# EAGLE design Mirley_USB-UART (EAGLE 9.5.1)

## Sheet 1 of 2: Mirley board to evaluate ESP8266
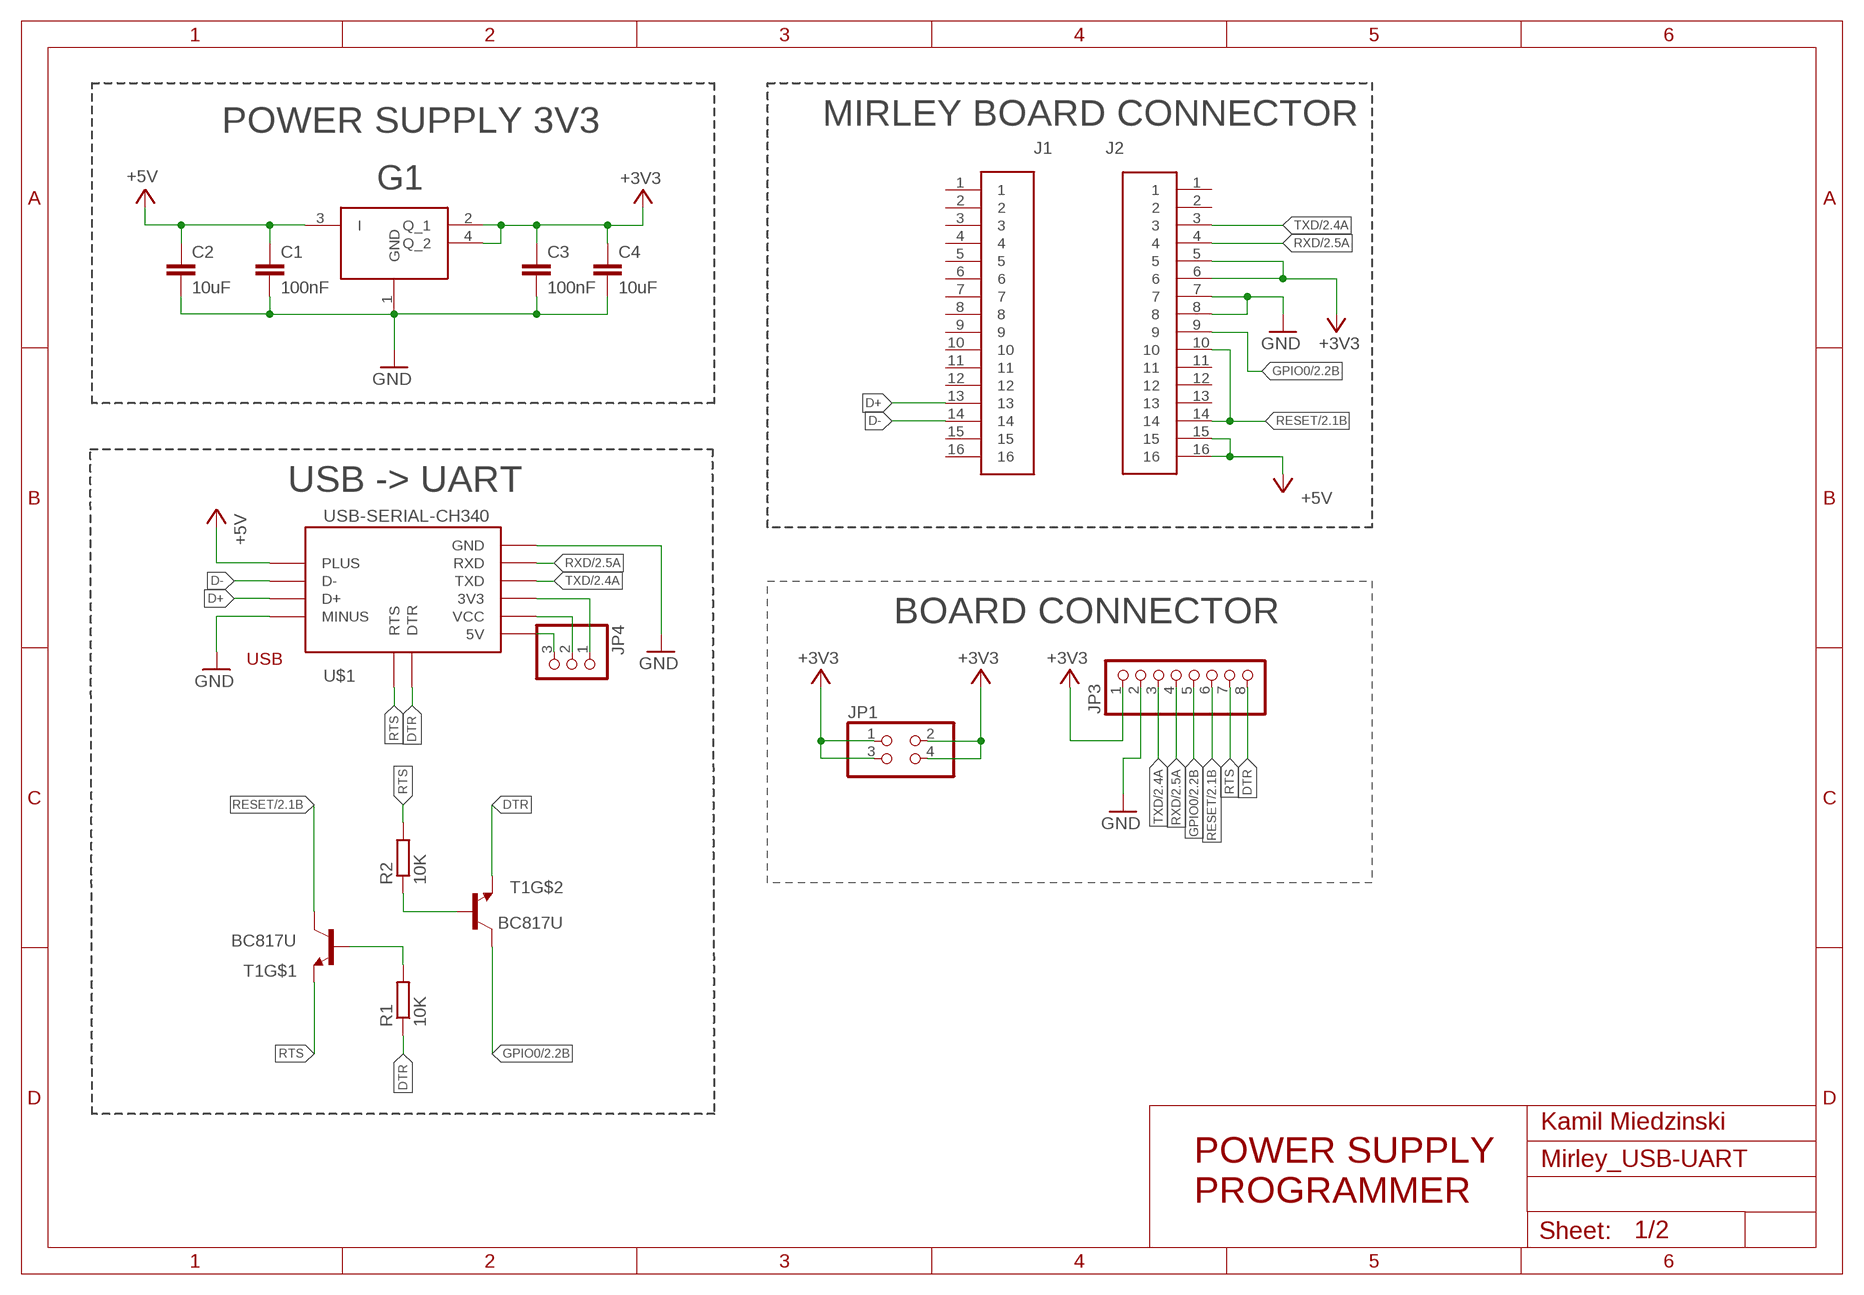
[diagram p0: schematic, sheet 1]

### Parts
C1  100nF  C-EUC0805K  [C0805K]
C2  10uF  C-EUC0805K  [C0805K]
C3  100nF  C-EUC0805K  [C0805K]
C4  10uF  C-EUC0805K  [C0805K]
G1  IFX1117ME_V33  [SOT230P700X170-4N-1]
J1  61301611121  [61301611121]
J2  61301611121  [61301611121]
JP1  PINHD-2X2  [2X02]
JP3  PINHD-1X8  [1X08]
JP4  PINHD-1X3  [1X03]
R1  10K  R-EU_R0805  [R0805]
R2  10K  R-EU_R0805  [R0805]
T1  BC817U  [INF-SC74]
U$1  USB-SERIAL-CH340  [USB-SERIAL-CH340]

### Nets
+3V3: C3.1 C4.1 G1.2(Q_1) G1.4(Q_2) J2.5 J2.6 JP1.1 JP1.2 JP1.3 JP1.4 JP3.1 ; also sheet 2
+5V: C1.1 C2.1 G1.3(I) J2.15 J2.16 U$1.PLUS ; also sheet 2
D+: J1.13 U$1.D+
D-: J1.14 U$1.D-
DTR: JP3.8 R1.1 T1.4(E) U$1.DTR
GND: C1.2 C2.2 C3.2 C4.2 G1.1(GND) J2.7 J2.8 JP3.2 U$1.GND U$1.MINUS ; also sheet 2
GPIO0: J2.9 JP3.5 T1.3(C) ; also sheet 2
N$1: R2.1 T1.5(B)
N$2: R1.2 T1.2(B)
N$5: JP4.3 U$1.5V
N$11: JP4.2 U$1.VCC
N$13: JP4.1 U$1.3V3
RESET: J2.10 J2.14 JP3.6 T1.6(C) ; also sheet 2
RTS: JP3.7 R2.2 T1.1(E) U$1.RTS
RXD: J2.4 JP3.4 U$1.RXD ; also sheet 2
TXD: J2.3 JP3.3 U$1.TXD ; also sheet 2
Unconnected: J1.1 J1.2 J1.3 J1.4 J1.5 J1.6 J1.7 J1.8 J1.9 J1.10 J1.11 J1.12 J1.15 J1.16 J2.1 J2.2 J2.11 J2.12 J2.13

### Notes on the sheet
- POWER SUPPLY 3V3 | MIRLEY BOARD CONNECTOR
- USB -> UART
- BOARD CONNECTOR
- Kamil Miedzinski
- POWER SUPPLY
  PROGRAMMER

## Sheet 2 of 2: Connector to adapter ESP8266 01, 07, 12
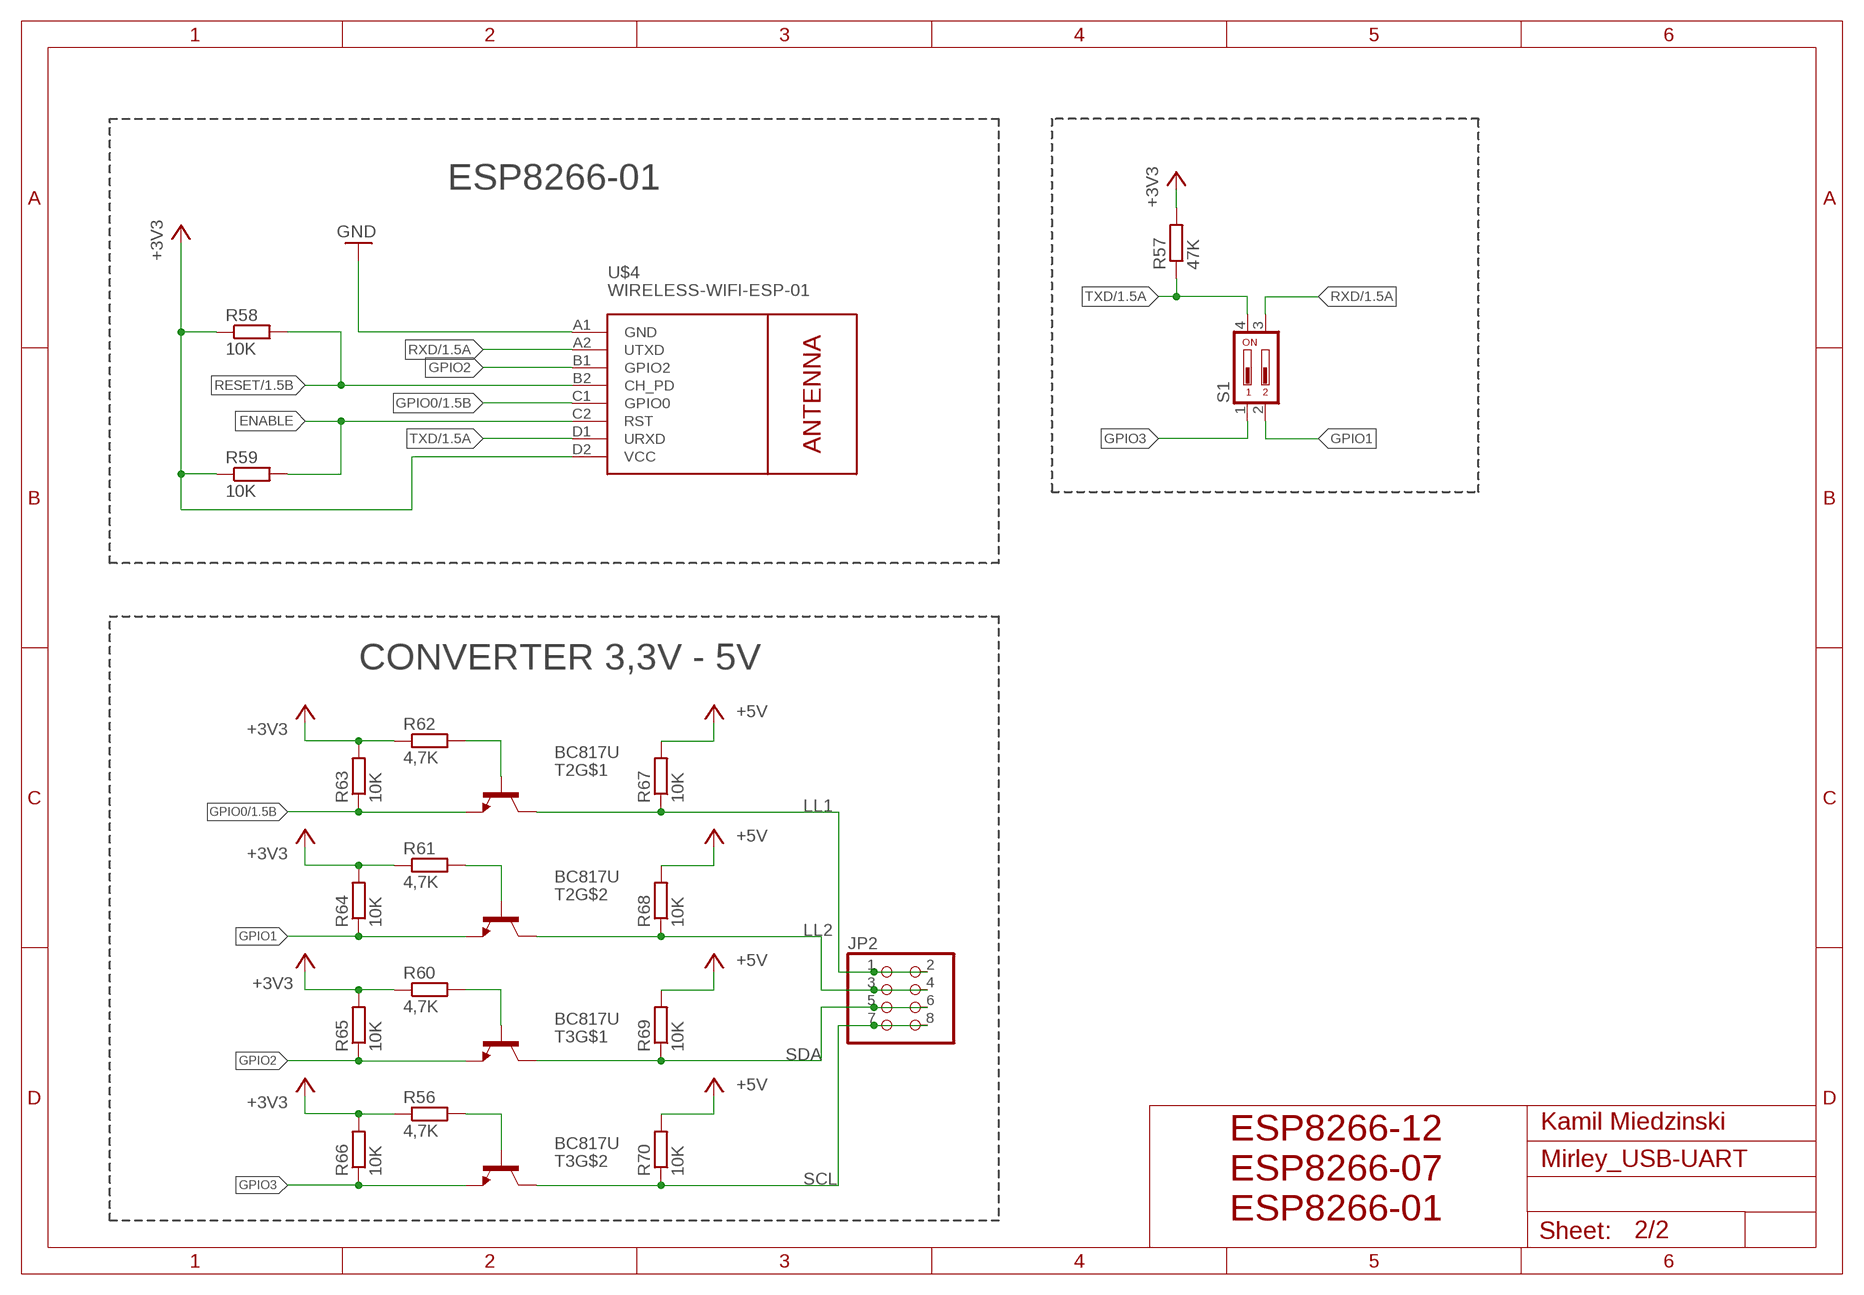
[diagram p1: schematic, sheet 2]

### Parts
JP2  PINHD-2X4  [2X04]
R56  4,7K  R-EU_R0805  [R0805]
R57  47K  R-EU_R0805  [R0805]
R58  10K  R-EU_R0805  [R0805]
R59  10K  R-EU_R0805  [R0805]
R60  4,7K  R-EU_R0805  [R0805]
R61  4,7K  R-EU_R0805  [R0805]
R62  4,7K  R-EU_R0805  [R0805]
R63  10K  R-EU_R0805  [R0805]
R64  10K  R-EU_R0805  [R0805]
R65  10K  R-EU_R0805  [R0805]
R66  10K  R-EU_R0805  [R0805]
R67  10K  R-EU_R0805  [R0805]
R68  10K  R-EU_R0805  [R0805]
R69  10K  R-EU_R0805  [R0805]
R70  10K  R-EU_R0805  [R0805]
S1  DIP02YL  [DIP02YL]
T2  BC817U  [INF-SC74]
T3  BC817U  [INF-SC74]
U$4  WIRELESS-WIFI-ESP-01  [WIRELESS-WIFI-ESP-01]

### Nets
+3V3: R56.1 R57.2 R58.1 R59.1 R60.1 R61.1 R62.1 R63.2 R64.2 R65.2 R66.2 U$4.D2(VCC) ; also sheet 1
+5V: R67.2 R68.2 R69.2 R70.2 ; also sheet 1
ENABLE: R59.2 U$4.C2(RST)
GND: U$4.A1(GND) ; also sheet 1
GPIO0: R63.1 T2.1(E) U$4.C1(GPIO0) ; also sheet 1
GPIO1: R64.1 S1.2 T2.4(E)
GPIO2: R65.1 T3.1(E) U$4.B1(GPIO2)
GPIO3: R66.1 S1.1 T3.4(E)
LL1: JP2.1 JP2.2 R67.1 T2.6(C)
LL2: JP2.3 JP2.4 R68.1 T2.3(C)
N$17: R62.2 T2.2(B)
N$18: R61.2 T2.5(B)
N$19: R60.2 T3.2(B)
N$21: R56.2 T3.5(B)
RESET: R58.2 U$4.B2(CH_PD) ; also sheet 1
RXD: S1.3 U$4.A2(UTXD) ; also sheet 1
SCL: JP2.7 JP2.8 R70.1 T3.3(C)
SDA: JP2.5 JP2.6 R69.1 T3.6(C)
TXD: R57.1 S1.4 U$4.D1(URXD) ; also sheet 1

### Notes on the sheet
- ESP8266-01
- CONVERTER 3,3V - 5V
- Kamil Miedzinski
- ESP8266-12
  ESP8266-07
  ESP8266-01

## Library data of the parts
C1-C4 = rcl:C-EU: CAPACITOR, European symbol; SPICEPREFIX: C
G1 = infineon:IFX1117ME_V33: IFX1117ME V33 SOT230P700X170-4N-1 Voltage Regulator
J1 J2 = Headers:61301611121: CONN HEADER VERT 16POS 2.54MM Manufacturer's datasheet <https://katalog.we-online.de/em/datasheet/6130xx11121.pdf>; CREATED_BY: PCBLayout.com; DIGIKEY_PART_NUMBER: 732-5327-ND; MANUFACTURER: Wurth Electronics Inc.; MPN: 61301611121
JP1 = pinhead:PINHD-2X2: PIN HEADER; SPICEPREFIX: E
JP2 = pinhead:PINHD-2X4: PIN HEADER
JP3 = pinhead:PINHD-1X8: PIN HEADER
JP4 = pinhead:PINHD-1X3: PIN HEADER
R1 R2 R56-R70 = rcl:R-EU_: RESISTOR, European symbol; SPICEPREFIX: R
S1 = switch-dil:DIP02YL: DIL/CODE SWITCH; OC_FARNELL: unknown; OC_NEWARK: unknown
T1-T3 = transistor:BC817U: NPN TRANSISTOR
U$1 = diy-modules:USB-SERIAL-CH340: USB to Serial UART Converter based on CP2102 chip More information about CP2102 chip is available here: https://www.silabs.com/documents/public/data-sheets/CP2102-9.pdf Drivers for CP210x devices are available here: http://www.silabs.com/products/development-tools/software/usb-to-uart-bridge-vcp-drivers Click here to find device on ebay.com <http://www.ebay.com/sch/cp2102+micro+usb>
U$4 = diy-modules:WIRELESS-WIFI-ESP-01: Wireless Wi-Fi ESP-01 Module based on ESP8266 chip Click here to find device on ebay.com <http://www.ebay.com/sch/esp8266+esp+01+transceiver>

## Board
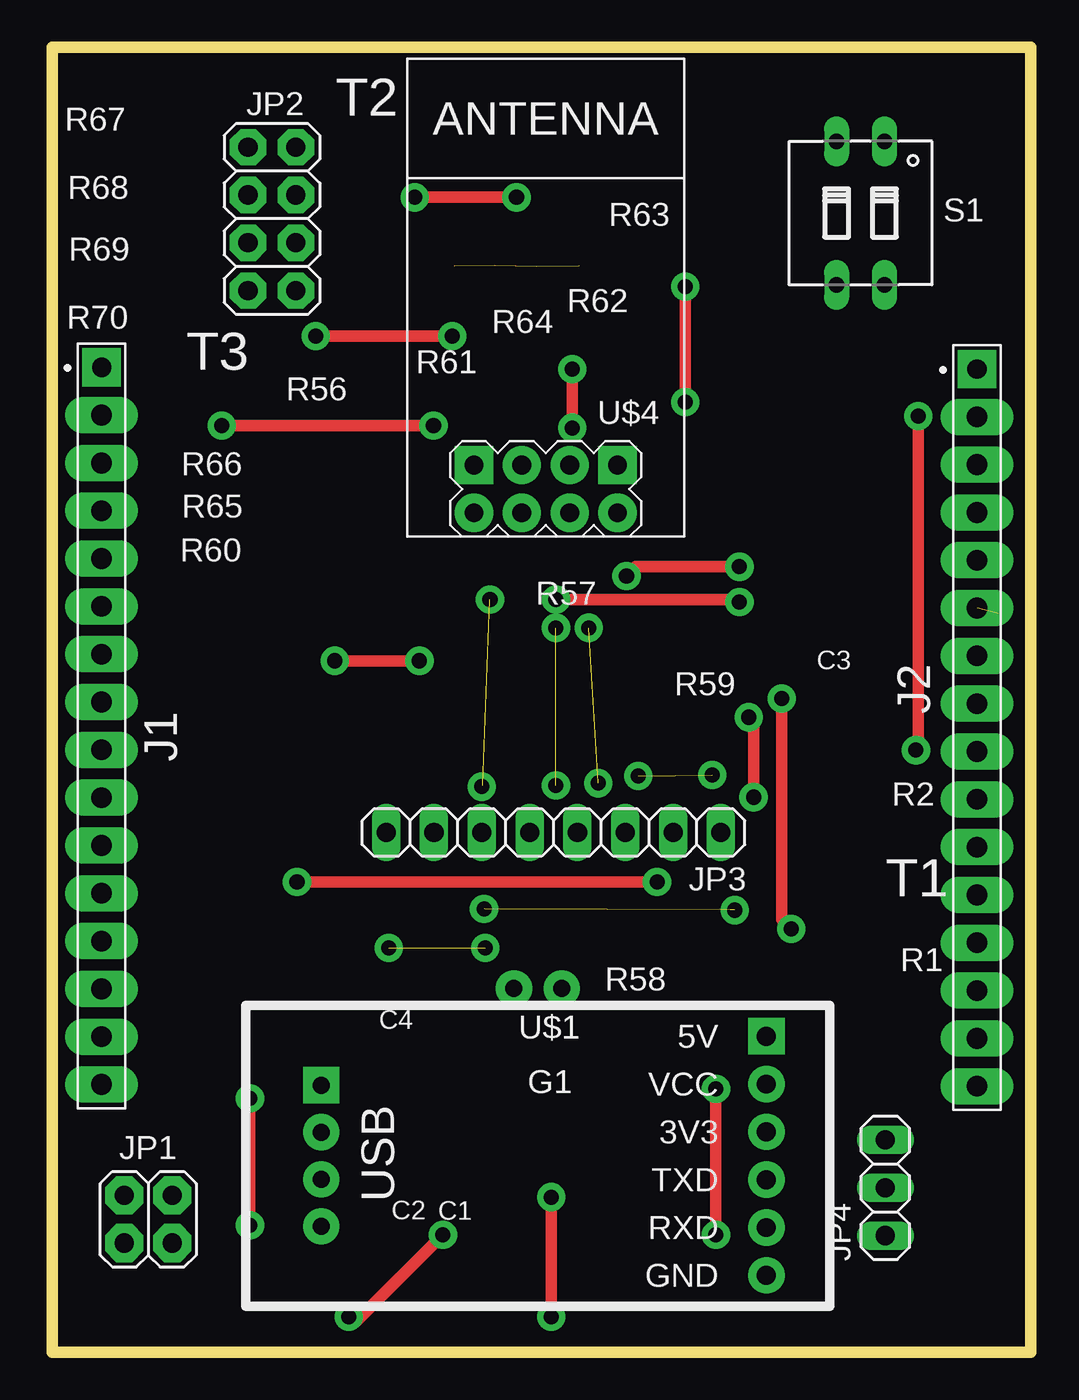
[diagram p2: board, top side]
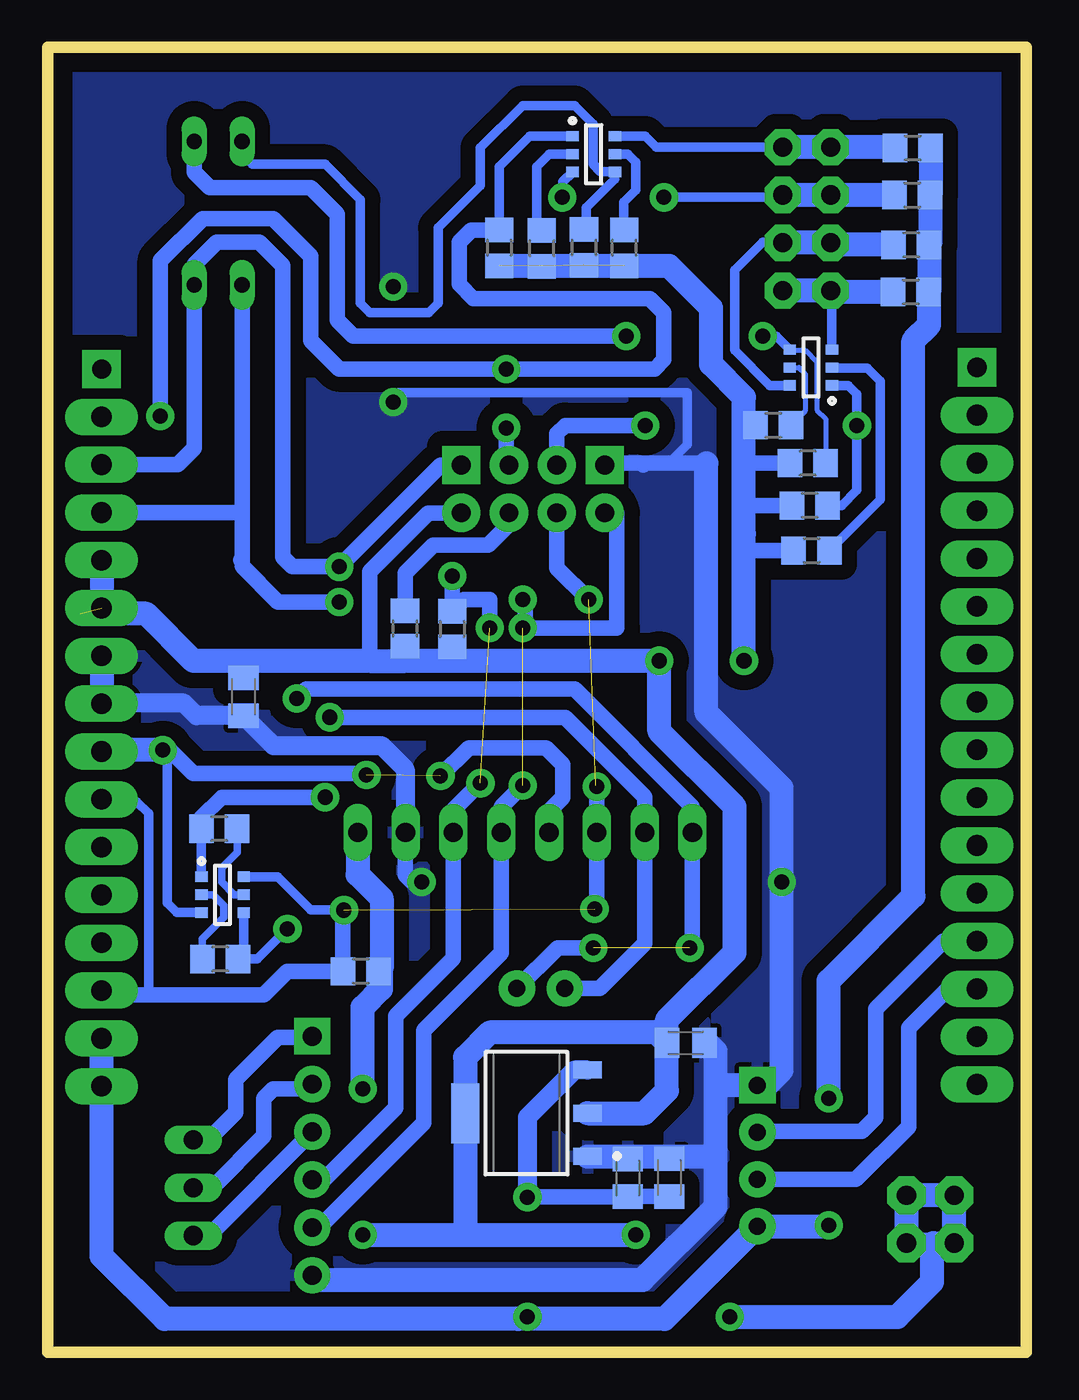
[diagram p3: board, bottom side, seen from below]

Size 51.97 x 69.36 mm. Coordinates in mm from the lower left corner, seen from the top.
Outline: 0,0 51.97,0 51.97,69.36 0,69.36 0,0
Copper layers (1*16): Top 0.035mm / dielectric 1.5mm / Bottom 0.035mm
Design rules "default": minimum track width 6mil, minimum drill 0.35mm, track to track 6mil, track to pad 6mil, pad to pad 6mil, via to via 6mil, smd to smd 6mil, copper to edge 40mil, drill to drill 6mil, minimum pad ring 10mil, minimum via ring 8mil, stop-mask expansion 4mil, vias tented up to drill 0mil, thermal gap 10mil

### Footprints (pad centres in the part's own frame; a part is rotated, then mirrored left to right if it is on the bottom)
C0805K = smd 1.3 x 1.6: 1 -1,0; 2 1,0
SOT230P700X170-4N-1 = smd 1.5 x 0.9: 1 -3.25,2.3; 2 -3.25,0; 3 -3.25,-2.3 | smd 1.5 x 3.2: 4 3.25,0
61301611121 = drill 1.016 pad 2.032 square: 1 -19.05,0 | drill 1.1 pad 1.93 long: 2 -16.51,0; 3 -13.97,0; 4 -11.43,0; 5 -8.89,0; 6 -6.35,0; 7 -3.81,0; 8 -1.27,0; 9 1.27,0; 10 3.81,0; 11 6.35,0; 12 8.89,0; 13 11.43,0; 14 13.97,0; 15 16.51,0; 16 19.05,0
2X02 = drill 1.016 pad 2.032 octagon: 1 -1.27,-1.27; 2 -1.27,1.27; 3 1.27,-1.27; 4 1.27,1.27
2X04 = drill 1.016 pad 1.93 octagon: 1 -3.81,-1.27; 2 -3.81,1.27; 3 -1.27,-1.27; 4 -1.27,1.27; 5 1.27,-1.27; 6 1.27,1.27; 7 3.81,-1.27; 8 3.81,1.27
1X08 = drill 1.016 long: 1 -8.89,0; 2 -6.35,0; 3 -3.81,0; 4 -1.27,0; 5 1.27,0; 6 3.81,0; 7 6.35,0; 8 8.89,0
1X03 = drill 1.016 long: 1 -2.54,0; 2 0,0; 3 2.54,0
R0805 = smd 1.3 x 1.5: 1 -0.95,0; 2 0.95,0
DIP02YL = drill 0.813 long: 1 -1.27,-3.81; 2 1.27,-3.81; 3 1.27,3.81; 4 -1.27,3.81
INF-SC74 = smd 0.65 x 0.55: 1 -1.125,0.95; 2 -1.125,0; 3 -1.125,-0.95; 4 1.125,-0.95; 5 1.125,0; 6 1.125,0.95
USB-SERIAL-CH340 = drill 1 pad 1.93: 3V3 12.14,1.27; GND 12.14,-6.35; RXD 12.14,-3.81; TXD 12.14,-1.27; VCC 12.14,3.81 | drill 1 pad 1.93 square: 5V 12.14,6.35 | drill 0.9 pad 1.93: D+ -11.5,1.25; D- -11.5,-1.25; DTR 1.27,8.89; PLUS -11.5,-3.75; RTS -1.27,8.89 | drill 0.9 pad 1.93 square: MINUS -11.5,3.75
WIRELESS-WIFI-ESP-01 = drill 1 pad 2.032 square: A1 -8.89,3.81; D1 -8.89,-3.81 | drill 1 pad 2.032: A2 -11.43,3.81; B1 -8.89,1.27; B2 -11.43,1.27; C1 -8.89,-1.27; C2 -11.43,-1.27; D2 -11.43,-3.81

### Placement (x,y rotation side)
C1  21.17,9.27 90 bottom
C2  18.96,9.29 90 bottom
C3  41.58,34.84 270 bottom
C4  18.09,16.44 0 bottom
G1  26.56,12.71 180 bottom
J1  2.62,33.29 270 top
J2  49.12,33.2 270 top
JP1  5.1,7.08 0 top
JP2  11.67,60.23 270 top
JP3  26.62,27.62 180 top
JP4  44.25,8.75 90 top
R1  42.82,20.9 180 bottom
R2  42.87,27.83 180 bottom
R56  13.45,49.27 0 bottom
R57  30.5,38.44 270 bottom
R58  35.36,20.25 180 bottom
R59  33,38.46 90 bottom
R60  11.41,42.61 0 bottom
R61  21.36,58.69 90 bottom
R62  25.73,58.66 90 bottom
R63  28,58.69 270 bottom
R64  23.5,58.72 270 bottom
R65  11.51,45 180 bottom
R66  11.61,47.25 180 bottom
R67  6.04,64 0 bottom
R68  6.07,61.5 0 bottom
R69  6.12,58.85 0 bottom
R70  6.14,56.35 0 bottom
S1  42.93,60.54 180 top
T1  42.69,24.32 0 bottom
T2  22.98,63.67 0 bottom
T3  11.45,52.33 180 bottom
U$1  25.79,10.45 0 top
U$4  26.21,56.04 90 top

### Tracks (layer width: path | path; a pad name or v marks a point on that pad's centre or on a via)
+3V3  (via drill 0.8 pad 1.5)  (4 unrouted)
  Top 0.61: v35.25,14 v35.25,6.25 | v20.75,6.25 16.07,1.57 v15.75,1.89 | v19.5,36.75 v15,36.75
  Bottom 0.813: R58.1 34.15,19.98 | U$4.D2 31.77,44.61 34.88,41.51 34.88,36.75 | R66.2 15,47.25 | 14.98,43.52 15,43.5 | R65.2 15,45 | 15,42.5 14.89,42.61 R60.1 | R59.1 33,36.75 | 30.5,37.25 R57.2 30,36.99 30,36.75 30.5,37.25
  Bottom 1.016: R56.1 14.73,49.27 15,49
  Bottom 1.27: G1.2 20.29,12.71 19.09,13.91 C4.1 | G1.4 29.81,15.69 28.5,17 19.65,17 C4.1 | G1.4 29.81,11.94 | v35.25,14 35.25,18.34 34.28,19.31 34.28,20.12 R58.1 34.25,20.41 34.25,24.12 35.52,25.39 JP3.1 | C4.1 19.09,17.66 15.5,21.25 15.5,29 19.5,33 v19.5,36.75 30,36.75 33,36.75 34.88,36.75 42,36.75 | G1.4 29.81,6.56 29.5,6.25 | v35.25,6.25 29.5,6.25 | 29.5,6.25 v20.75,6.25 | v15.75,1.89 6.86,1.89 5,3.75 5,5.75 | 5,5.75 4.94,5.81 JP1.1 JP1.2 JP1.4 JP1.3 6.31,5.75 5,5.75 | 50.25,39.25 46.75,39.25 44.25,36.75 42,36.75 | C3.1 41.58,36.33 42,36.75 | v15,36.75 15,42.5 15,43.5 15,45 15,47.25 15,49 15,50.75 16.75,52.5 16.75,55.5 18.99,57.74 R63.2 | J2.5 J2.6
+5V  (via drill 0.8 pad 1.5)
  Top 0.61: v26.5,8.25 v26.5,1.89 | v10.5,6.75 v10.5,13.5
  Top 1.016: v26.5,1.89 26.5,1.75
  Bottom 0.813: C2.1 21.15,8.29 C1.1 26.48,8.27 v26.5,8.25 | R68.2 5.21,61.6 | R70.2 5.04,56.5
  Bottom 1.016: G1.3 23.99,15.01 26.5,12.5 v26.5,8.25 | v26.5,1.89 26.89,1.89 27,1.78
  Bottom 1.27: J2.15 J2.16 49.12,5.12 45.78,1.78 27,1.78 19.21,1.78 U$1.PLUS 10.55,6.7 v10.5,6.75 | v10.5,13.5 10.5,19.75 6,24.25 6,53.75 5.17,54.59 5.17,56.33 | 5.17,56.33 R70.2 | R67.2 5.09,61.52 R68.2 5.12,58.9 R69.2 5.17,56.33
D+
  Bottom 0.813: J1.13 4.39,21.86 8,18.25 8,12.5 8.75,11.75 14.24,11.75 U$1.D+
D-
  Bottom 0.813: J1.14 4.18,19.32 6.25,17.25 6.25,12 9.05,9.2 U$1.D-
DTR  (via drill 0.8 pad 1.5)  (1 unrouted)
  Top 0.61: v38.75,34.75 38.75,23 v39.25,22.5
  Bottom 0.508: T1.4 41.56,21.2 R1.1 40.85,20.9 v39.25,22.5
  Bottom 0.813: U$1.DTR 24.9,21.5 v23,21.5 | v38.75,34.75 38.25,35.25 24,35.25 17.73,28.98 JP3.8 17.73,21.64 v17.88,21.5
ENABLE
  Bottom 0.813: R59.2 33,41.41 31.5,42.91 28.59,42.91 27.48,44.02 U$4.C2
GND  (via drill 0.8 pad 1.5)
  Top 0.61: v13,25 v32.12,25 | v33.62,50.5 v33.62,56.62
  Bottom 0.508: 19,47.25 18,48.25 18,51 33.38,51 33.62,50.75 v33.62,50.5
  Bottom 0.813: 20.35,47.15 20.25,47.25 | 17,47.25 19,47.25 22.3,47.25 U$4.A1 | JP3.2 33,27.65 33,25.38 32.62,25 v32.12,25
  Bottom 1.016: 49.09,34.5 44.75,34.5 44.09,33.84 C3.2 40,32.25 34.25,32.25 33,31 33,27.65
  Bottom 1.27: U$1.GND 37.68,3.85 20.4,3.85 16.5,7.75 16.5,10.41 | G1.1 16.5,10.41 | C4.2 16.94,16.44 16.5,16 16.5,14 | 16.5,10.41 16.5,14 | 16.5,14 16.3,14.2 U$1.MINUS 13.8,14.2 13,15 v13,25 13,30 17,34 17,47.25 | J2.7 49.12,34.53 49.09,34.5
  pour Bottom (isolate 0.813): 0,69.36 0,0 51.97,0 51.97,69.36
GPIO0  (via drill 0.8 pad 1.5)  (1 unrouted)
  Top 0.61: v46,49.75 46,32.12 | v27.62,52.25 v27.62,49.12
  Top 0.813: v45.88,32 46,32.12
  Bottom 0.508: T2.1 26.38,64.62 28,63 R63.1 | T1.3 45.12,23.37 45.62,23.88 45.62,31.88 45.5,32
  Bottom 0.813: v45.88,32 45.5,32 44.25,30.75 35.12,30.75 | v46,49.75 46,58 43.75,60.25 40,60.25 38,58.25 38,53.75 36.5,52.25 v27.62,52.25 19.75,52.25 19.25,52.75 19.25,55.25 20,56 29.38,56 30.12,56.75 30.12,59 29.48,59.64 R63.1 | v27.62,49.12 27.62,47.3 U$4.C1 | JP3.5 25.36,28.77 24.62,29.5 24.62,31.25 25.5,32.12 29.62,32.12 v31.12,30.62
  Bottom 1.016: v35.05,30.68 35.12,30.75
  Bottom 1.27: v45.88,32 49.05,32 J2.9
GPIO1
  Bottom 0.508: R64.1 23.38,59.79 23.38,60.83 21.86,62.34 T2.4 21.89,62.75 22.62,62.75 23,63.12 23,65.25 24,66.25 26.75,66.25 29,64 29,62 31.25,59.75 31.25,55.75 31.75,55.25 34.88,55.25 35.38,55.75 35.38,61.25 37.25,63.12 41.12,63.12 41.75,63.75 41.75,64.25 41.75,64.44 S1.2
GPIO2  (via drill 0.8 pad 1.5)
  Top 0.61: v20.25,49.25 v9,49.25
  Bottom 0.508: U$4.B1 25,47.21 | T3.1 9.45,51.38 9,50.93 v9,49.25 9,45.81 9.81,45 R65.1
  Bottom 0.813: v20.25,49.25 24.5,49.25 24.94,48.81 U$4.B1
GPIO3  (via drill 0.8 pad 1.5)
  Top 0.61: v14,54 v21.25,54
  Bottom 0.254: R66.1 10.66,49.61 11.13,50.08 11.13,52.62 11.76,53.25 12.54,53.25
  Bottom 0.406: T3.4 12.54,53.25
  Bottom 0.508: T3.4 13.29,54 v14,54
  Bottom 0.813: v21.25,54 35.75,54 36.61,54.86 36.61,60.49 38,61.88 43.38,61.88 44.2,62.7 S1.1
LL1
  Bottom 0.508: 13,64.04 JP2.2 19.66,64.04 20.25,64.62 T2.6
  Bottom 0.813: JP2.1 10.36,64
  Bottom 1.27: R67.1 7.03,64.04 JP2.1 13,64.04
LL2  (via drill 0.8 pad 1.5)
  Top 0.61: v24.66,61.38 v19.25,61.38
  Bottom 0.508: JP2.4 13,61.5 13.12,61.38 v19.25,61.38 | T2.3 24.62,62.2 24.62,61.38 v24.66,61.38
  Bottom 1.27: R68.1 JP2.3 13,61.5
N$1
  Bottom 0.406: T1.5 42.07,24.32 42.75,25 42.75,25.75 41.92,26.58 R2.1
  Bottom 0.61: 41.75,27.66 R2.1
N$2
  Bottom 0.406: T1.2 43.2,24.32 42.62,23.75 42.62,23.12 43.77,21.98 R1.2
N$5
  Bottom 0.813: U$1.5V 37.98,16.75 39.75,16.75 42,14.5 42,12.75 43.46,11.29 JP4.3
N$11
  Bottom 0.813: 37.99,14.26 U$1.VCC 38.19,14 40,14 40.5,13.5 40.5,11.5 43.25,8.75 JP4.2
N$13
  Bottom 0.813: 38.18,11.72 U$1.3V3 43.44,6.21 JP4.1
N$17
  Bottom 0.508: T2.2 25.33,63.67 26,63 26,59.88 R62.2
N$18
  Bottom 0.508: T2.5 21.17,63.67 20.75,63.25 20.75,61.75 21.38,61.12 21.38,59.66 R61.2
N$19
  Bottom 0.508: T3.2 10.31,52.31 8.46,52.31 7.75,51.6 7.75,45.32 R60.2
N$21
  Bottom 0.254: T3.5 12.08,52.33 11.75,52 11.75,50.02 R56.2
  Bottom 0.406: T3.5 12.49,52.25
RESET  (via drill 0.8 pad 1.5)  (3 unrouted)
  Bottom 0.508: T1.6 39.77,25.27 38,23.5 36,23.5 | J2.10 48.98,29.25 47.25,29.25 46.62,28.62 46.62,19
  Bottom 0.813: v36.25,23.5 36.25,23 36.31,22.94 R58.2 39.25,20.25 40.5,19 46.62,19 48.89,19 J2.14 | v23.25,40 24.94,41.69 U$4.B2 | 22.88,30.12 v22.82,30.07 JP3.6 22.82,23.56 22.88,23.5 v22.94,23.56
RTS  (via drill 0.8 pad 1.5)
  Top 0.61: v37,33.75 37.25,33.5 v37.25,29.5
  Bottom 0.508: T1.1 R2.2
  Bottom 0.61: R2.2
  Bottom 0.813: U$1.RTS 22.66,19.34 20.27,21.73 JP3.7 20.27,29.52 24.5,33.75 v37,33.75 | R2.2 43.82,28.43 42.75,29.5 v37.25,29.5
RXD  (via drill 0.8 pad 1.5)  (1 unrouted)
  Top 0.61: v26.75,40 36.38,40 v36.5,39.88
  Bottom 0.813: v36.5,39.88 39.75,39.88 41.66,41.78 41.66,42.16 | S1.3 41.66,44.62 | 41.66,44.62 41.66,42.16 | 41.73,42.09 41.66,42.16 | J2.4 41.66,44.63 41.66,44.62 | U$4.A2 21.75,44.61 21.75,38.5 v26.75,38.5 26.62,38.62 26.62,39.88 v26.75,40 | U$1.RXD 37.55,6.64 32,12.2 32,17.12 27.89,21.23 JP3.4 27.89,28.98 v26.75,30.12
SCL
  Bottom 0.508: T3.3 10.32,56.34
  Bottom 0.813: R70.1 7.16,56.42 | 10.32,56.34 JP2.7
  Bottom 1.27: R70.1 10.33,56.35 JP2.7 JP2.8
SDA
  Bottom 0.508: T3.6 13.63,51.38 15.5,53.25 15.5,57.5 14,59 12.98,59
  Bottom 0.813: 10.29,58.85 JP2.5 | 12.98,59 JP2.6
  Bottom 1.27: R69.1 10.29,58.85 | JP2.5 JP2.6
TXD  (via drill 0.8 pad 1.5)  (1 unrouted)
  Top 0.61: v36.5,41.75 31,41.75 v30.5,41.25
  Bottom 0.813: 28.5,39 v28.5,38.5 28.5,40 29.89,40 R57.1 v30.5,41.25 | J2.3 45.08,47.17 44.2,48.05 S1.4 44.2,57.8 43,59 40.75,59 39.5,57.75 39.5,42.25 39,41.75 v36.5,41.75 31.1,47.15 U$4.D1 | U$1.TXD 37.32,9.18 33.5,13 33.5,17.88 30.43,20.94 JP3.3 30.43,28.82 v29,30.25

### Text on the board
tTest: ANTENNA | TX | RX | ESP-01
Reference: GPIO - ON | GPIO0 | GPIO1 | GPIO2 | GPIO3 | DTR | RTS | RESET | GPIO0 | TX | RX | GND | 3,3V | USB - UART | 5V | VCC | 3,3V | 3,3V